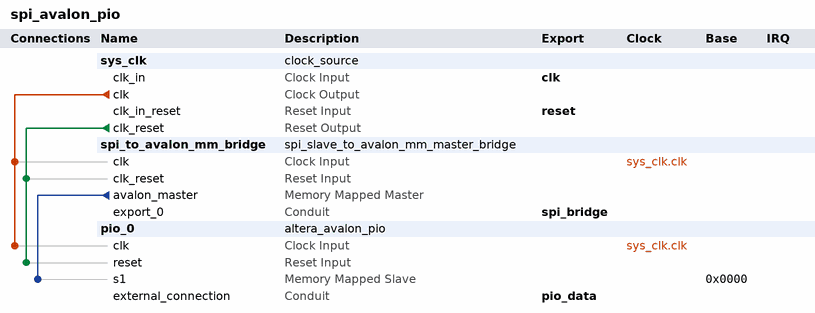
[diagram p0: system contents]
# Platform Designer (Qsys) system spi_avalon_pio, Cyclone V 5CSXFC6D6F31C6
# Parameters at their usual value, and those the tool derives, are not listed.
package require -exact qsys 14.1
create_system spi_avalon_pio
set_project_property DEVICE_FAMILY {Cyclone V}
set_project_property DEVICE 5CSXFC6D6F31C6

add_instance sys_clk clock_source 14.1
set_instance_parameter_value sys_clk clockFrequency 50000000

add_instance spi_to_avalon_mm_bridge spi_slave_to_avalon_mm_master_bridge 14.1
set_instance_parameter_value spi_to_avalon_mm_bridge SYNC_DEPTH 2

add_instance pio_0 altera_avalon_pio 14.1
set_instance_parameter_value pio_0 direction Output
set_instance_parameter_value pio_0 resetValue 858993
set_instance_parameter_value pio_0 width 32

# connections
add_connection sys_clk.clk pio_0.clk clock
add_connection sys_clk.clk spi_to_avalon_mm_bridge.clk clock
add_connection sys_clk.clk_reset pio_0.reset reset
add_connection sys_clk.clk_reset spi_to_avalon_mm_bridge.clk_reset reset
add_connection spi_to_avalon_mm_bridge.avalon_master pio_0.s1 avalon
set_connection_parameter_value spi_to_avalon_mm_bridge.avalon_master/pio_0.s1 baseAddress 0x0000

# exported interfaces
add_interface clk clock sink
set_interface_property clk EXPORT_OF sys_clk.clk_in
add_interface pio_data conduit end
set_interface_property pio_data EXPORT_OF pio_0.external_connection
add_interface reset reset sink
set_interface_property reset EXPORT_OF sys_clk.clk_in_reset
add_interface spi_bridge conduit end
set_interface_property spi_bridge EXPORT_OF spi_to_avalon_mm_bridge.export_0

set_interconnect_requirement {$system} qsys_mm.clockCrossingAdapter HANDSHAKE
set_interconnect_requirement {$system} qsys_mm.insertDefaultSlave FALSE
set_interconnect_requirement {$system} qsys_mm.maxAdditionalLatency 1

save_system spi_avalon_pio.qsys
